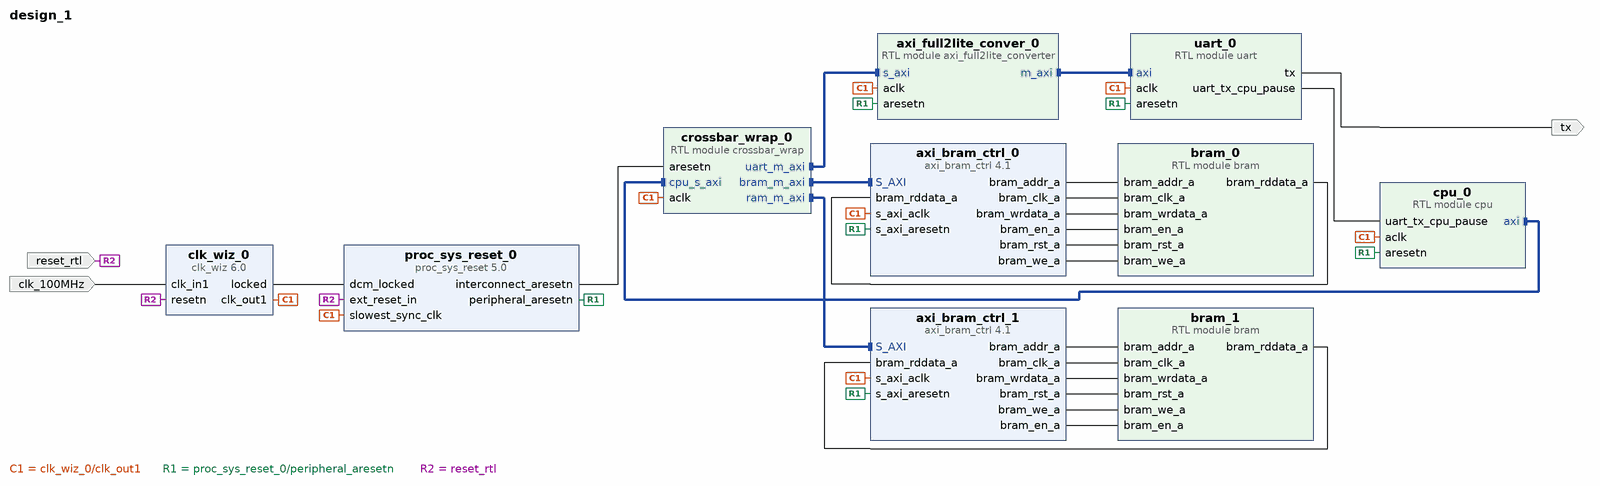
[diagram p0: block diagram of the top level]
# Vivado block design design_1, xc7z020clg400-1, Vivado 2020.2
create_bd_design design_1

create_bd_port -dir I -type clk clk_100MHz
set_property -dict {CONFIG.FREQ_HZ 100000000} [get_bd_ports clk_100MHz]
create_bd_port -dir O tx
create_bd_port -dir I -type rst reset_rtl

create_bd_cell -type ip -vlnv xilinx.com:ip:proc_sys_reset:5.0 proc_sys_reset_0
set_property -dict {CONFIG.C_AUX_RESET_HIGH 0} [get_bd_cells proc_sys_reset_0]
create_bd_cell -type module -reference crossbar_wrap crossbar_wrap_0
create_bd_cell -type module -reference axi_full2lite_converter axi_full2lite_conver_0
create_bd_cell -type module -reference bram bram_0
set_property -dict {CONFIG.select_app simb} [get_bd_cells bram_0]
create_bd_cell -type module -reference bram bram_1
set_property -dict {CONFIG.select_app main} [get_bd_cells bram_1]
create_bd_cell -type module -reference cpu cpu_0
set_property -dict [list \
  CONFIG.alu_type DEFAULT \
  CONFIG.cache_enable True \
  CONFIG.cache_replace_policy RR \
  CONFIG.mult_type DEFAULT \
  CONFIG.shifter_type DEFAULT \
] [get_bd_cells cpu_0]
create_bd_cell -type module -reference uart uart_0
set_property -dict {CONFIG.clock_frequency 49400000 CONFIG.log_file uart_output.txt} [get_bd_cells uart_0]
create_bd_cell -type ip -vlnv xilinx.com:ip:axi_bram_ctrl:4.1 axi_bram_ctrl_0
set_property -dict {CONFIG.SINGLE_PORT_BRAM 1} [get_bd_cells axi_bram_ctrl_0]
create_bd_cell -type ip -vlnv xilinx.com:ip:axi_bram_ctrl:4.1 axi_bram_ctrl_1
set_property -dict {CONFIG.SINGLE_PORT_BRAM 1} [get_bd_cells axi_bram_ctrl_1]
create_bd_cell -type ip -vlnv xilinx.com:ip:clk_wiz:6.0 clk_wiz_0
set_property -dict [list \
  CONFIG.CLKOUT1_JITTER 313.516 \
  CONFIG.CLKOUT1_PHASE_ERROR 275.507 \
  CONFIG.CLKOUT1_REQUESTED_OUT_FREQ 49.400 \
  CONFIG.MMCM_CLKFBOUT_MULT_F 30.875 \
  CONFIG.MMCM_CLKOUT0_DIVIDE_F 15.625 \
  CONFIG.MMCM_DIVCLK_DIVIDE 4 \
  CONFIG.RESET_PORT resetn \
  CONFIG.RESET_TYPE ACTIVE_LOW \
] [get_bd_cells clk_wiz_0]

# ---- connections ----

connect_bd_intf_net [get_bd_intf_pins axi_bram_ctrl_0/S_AXI] [get_bd_intf_pins crossbar_wrap_0/bram_m_axi]
connect_bd_intf_net [get_bd_intf_pins crossbar_wrap_0/ram_m_axi] [get_bd_intf_pins axi_bram_ctrl_1/S_AXI]
connect_bd_intf_net [get_bd_intf_pins axi_full2lite_conver_0/m_axi] [get_bd_intf_pins uart_0/axi]
connect_bd_intf_net [get_bd_intf_pins crossbar_wrap_0/uart_m_axi] [get_bd_intf_pins axi_full2lite_conver_0/s_axi]
connect_bd_intf_net [get_bd_intf_pins cpu_0/axi] [get_bd_intf_pins crossbar_wrap_0/cpu_s_axi]
connect_bd_net [get_bd_ports clk_100MHz] [get_bd_pins clk_wiz_0/clk_in1]
connect_bd_net [get_bd_pins clk_wiz_0/clk_out1] \
  [get_bd_pins proc_sys_reset_0/slowest_sync_clk] [get_bd_pins crossbar_wrap_0/aclk] \
  [get_bd_pins axi_full2lite_conver_0/aclk] [get_bd_pins cpu_0/aclk] [get_bd_pins uart_0/aclk] \
  [get_bd_pins axi_bram_ctrl_0/s_axi_aclk] [get_bd_pins axi_bram_ctrl_1/s_axi_aclk]
connect_bd_net [get_bd_pins clk_wiz_0/locked] [get_bd_pins proc_sys_reset_0/dcm_locked]
connect_bd_net [get_bd_pins uart_0/uart_tx_cpu_pause] [get_bd_pins cpu_0/uart_tx_cpu_pause]
connect_bd_net [get_bd_pins uart_0/tx] [get_bd_ports tx]
connect_bd_net [get_bd_pins proc_sys_reset_0/interconnect_aresetn] [get_bd_pins crossbar_wrap_0/aresetn]
connect_bd_net [get_bd_pins proc_sys_reset_0/peripheral_aresetn] \
  [get_bd_pins axi_full2lite_conver_0/aresetn] [get_bd_pins cpu_0/aresetn] [get_bd_pins uart_0/aresetn] \
  [get_bd_pins axi_bram_ctrl_0/s_axi_aresetn] [get_bd_pins axi_bram_ctrl_1/s_axi_aresetn]
connect_bd_net -net ext_reset_in_0_1 [get_bd_ports reset_rtl] [get_bd_pins proc_sys_reset_0/ext_reset_in] [get_bd_pins clk_wiz_0/resetn]
connect_bd_net [get_bd_pins axi_bram_ctrl_0/bram_addr_a] [get_bd_pins bram_0/bram_addr_a]
connect_bd_net [get_bd_pins axi_bram_ctrl_0/bram_clk_a] [get_bd_pins bram_0/bram_clk_a]
connect_bd_net [get_bd_pins axi_bram_ctrl_0/bram_wrdata_a] [get_bd_pins bram_0/bram_wrdata_a]
connect_bd_net [get_bd_pins bram_0/bram_rddata_a] [get_bd_pins axi_bram_ctrl_0/bram_rddata_a]
connect_bd_net [get_bd_pins axi_bram_ctrl_0/bram_en_a] [get_bd_pins bram_0/bram_en_a]
connect_bd_net [get_bd_pins axi_bram_ctrl_0/bram_rst_a] [get_bd_pins bram_0/bram_rst_a]
connect_bd_net [get_bd_pins axi_bram_ctrl_0/bram_we_a] [get_bd_pins bram_0/bram_we_a]
connect_bd_net [get_bd_pins axi_bram_ctrl_1/bram_addr_a] [get_bd_pins bram_1/bram_addr_a]
connect_bd_net [get_bd_pins axi_bram_ctrl_1/bram_clk_a] [get_bd_pins bram_1/bram_clk_a]
connect_bd_net [get_bd_pins axi_bram_ctrl_1/bram_wrdata_a] [get_bd_pins bram_1/bram_wrdata_a]
connect_bd_net [get_bd_pins bram_1/bram_rddata_a] [get_bd_pins axi_bram_ctrl_1/bram_rddata_a]
connect_bd_net [get_bd_pins axi_bram_ctrl_1/bram_rst_a] [get_bd_pins bram_1/bram_rst_a]
connect_bd_net [get_bd_pins axi_bram_ctrl_1/bram_we_a] [get_bd_pins bram_1/bram_we_a]
connect_bd_net [get_bd_pins axi_bram_ctrl_1/bram_en_a] [get_bd_pins bram_1/bram_en_a]

# ---- address map ----
exclude_bd_addr_seg -offset 0x44A00000 -range 64K -target_address_space [get_bd_addr_spaces axi_full2lite_conver_0/m_axi] [get_bd_addr_segs uart_0/axi/reg0]
exclude_bd_addr_seg -offset 0x00000000 -range 4G -target_address_space [get_bd_addr_spaces cpu_0/axi] [get_bd_addr_segs crossbar_wrap_0/cpu_s_axi/reg0]
assign_bd_address -offset 0x00000000 -range 8K -target_address_space [get_bd_addr_spaces crossbar_wrap_0/bram_m_axi] [get_bd_addr_segs axi_bram_ctrl_0/S_AXI/Mem0]
assign_bd_address -offset 0x10000000 -range 32M -target_address_space [get_bd_addr_spaces crossbar_wrap_0/ram_m_axi] [get_bd_addr_segs axi_bram_ctrl_1/S_AXI/Mem0]
assign_bd_address -offset 0x20000000 -range 64K -target_address_space [get_bd_addr_spaces crossbar_wrap_0/uart_m_axi] [get_bd_addr_segs axi_full2lite_conver_0/s_axi/reg0]

validate_bd_design
save_bd_design
